# Altium schematic sheet FPGA Power.SCHDOC
size A
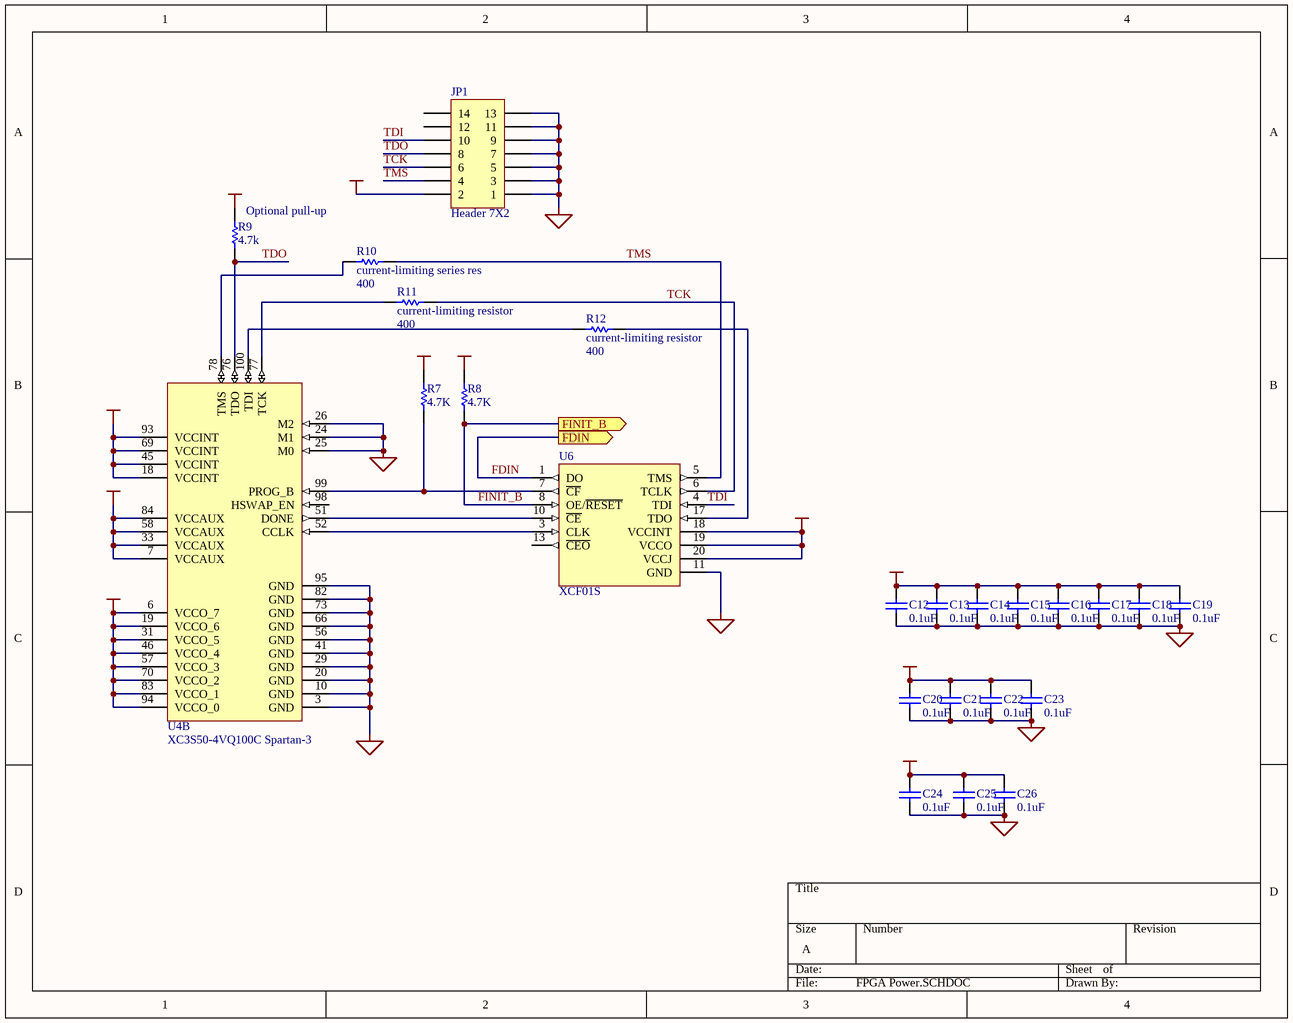
[diagram p0: FPGA Power.SCHDOC]

## Parts
C12  value 0.1uF  [CC1608-0603]  (hidden comment: Cap)
C13  value 0.1uF  [CC1608-0603]  (hidden comment: Cap)
C14  value 0.1uF  [CC1608-0603]  (hidden comment: Cap)
C15  value 0.1uF  [CC1608-0603]  (hidden comment: Cap)
C16  value 0.1uF  [CC1608-0603]  (hidden comment: Cap)
C17  value 0.1uF  [CC1608-0603]  (hidden comment: Cap)
C18  value 0.1uF  [CC1608-0603]  (hidden comment: Cap)
C19  value 0.1uF  [CC1608-0603]  (hidden comment: Cap)
C20  value 0.1uF  [CC1608-0603]  (hidden comment: Cap)
C21  value 0.1uF  [CC1608-0603]  (hidden comment: Cap)
C22  value 0.1uF  [CC1608-0603]  (hidden comment: Cap)
C23  value 0.1uF  [CC1608-0603]  (hidden comment: Cap)
C24  value 0.1uF  [CC1608-0603]  (hidden comment: Cap)
C25  value 0.1uF  [CC1608-0603]  (hidden comment: Cap)
C26  value 0.1uF  [CC1608-0603]  (hidden comment: Cap)
JP1  Header 7X2  [HDR2x7-2mm]
R7  value 4.7K  [CC1608-0603]  (hidden comment: Res1)
R8  value 4.7K  [CC1608-0603]  (hidden comment: Res1)
R9  Optional pull-up  value 4.7k  [CC1608-0603]
R10  current-limiting series res  value 400  [CC1608-0603]
R11  current-limiting resistor  value 400  [CC1608-0603]
R12  current-limiting resistor  value 400  [CC1608-0603]
U4  XC3S50-4VQ100C Spartan-3  [F-QFP14X14-G100/N]  (part B of 2)
U6  XCF01S  [TSSO6x6-G20/X.3]

## Ports
FDIN (out), FINIT_B (out)

## Nets
+1.2VCC: C20.1 C21.1 C22.1 C23.1 U4.18(VCCINT) U4.45(VCCINT) U4.69(VCCINT) U4.93(VCCINT)
+2.5VCC: C24.1 C25.1 C26.1 U4.7(VCCAUX) U4.33(VCCAUX) U4.58(VCCAUX) U4.84(VCCAUX)
GND: C12.2 C13.2 C14.2 C15.2 C16.2 C17.2 C18.2 C19.2 C20.2 C21.2 C22.2 C23.2 C24.2 C25.2 C26.2 JP1.1 JP1.3 JP1.5 JP1.7 JP1.9 JP1.11 JP1.13 U4.3(GND) U4.10(GND) U4.20(GND) U4.24(M1) U4.25(M0) U4.26(M2) U4.29(GND) U4.41(GND) U4.56(GND) U4.66(GND) U4.73(GND) U4.82(GND) U4.95(GND) U6.11(GND)
VCC: C12.1 C13.1 C14.1 C15.1 C16.1 C17.1 C18.1 C19.1 JP1.2 R7.2 R8.2 R9.2 U4.6(VCCO_7) U4.19(VCCO_6) U4.31(VCCO_5) U4.46(VCCO_4) U4.57(VCCO_3) U4.70(VCCO_2) U4.83(VCCO_1) U4.94(VCCO_0) U6.18(VCCINT) U6.19(VCCO) U6.20(VCCJ)
FDIN: U6.1(DO) ; port FDIN
FINIT_B: R8.1 U6.8(OE/~{RESET}) ; port FINIT_B
TCK: JP1.6 R11.1 U6.6(TCLK)
TDI: JP1.10 U6.4(TDI)
TDO: JP1.8 R9.1 U4.76(TDO)
TMS: JP1.4 R10.1 U6.5(TMS)
NetR7_1: R7.1 U4.99(PROG_B) U6.7(~{CF})
NetR10_2: R10.2 U4.78(TMS)
NetR11_2: R11.2 U4.77(TCK)
NetR12_1: R12.1 U6.17(TDO)
NetR12_2: R12.2 U4.100(TDI)
NetU4_51: U4.51(DONE) U6.10(~{CE})
NetU4_52: U4.52(CCLK) U6.3(CLK)

Not connected (* = marked no-connect by the designer): JP1 12 14; U4 98(HSWAP_EN); U6 13(~{CEO})

## Library data of the parts
C12-C26 = Cap: Capacitor; Manufacturer: Generic Components; Class I: Passive; Published: 8-Jun-2000; Revision: July-2002: Re-released for DXP Platform.; Publisher: Altium Limited; Class II: Capacitor
JP1 = Header 7X2: Header, 7-Pin, Dual row; Manufacturer: Generic Components; Class I: Connector; Revision: July-2002: Re-released for DXP Platform.; Publisher: Altium Limited
R7-R12 = Res1: Resistor; Manufacturer: Generic Components; Class I: Passive; Published: 8-Jun-2000; Revision: July-2002: Re-released for DXP Platform.; Publisher: Altium Limited; Class II: Resistor
U4 = XC3S50-4VQ100C: Xilinx Spartan-3 VQ100; Vendor: Xilinx
U6 = XCF01S: Xilinx Platform Flash; Vendor: Xilinx